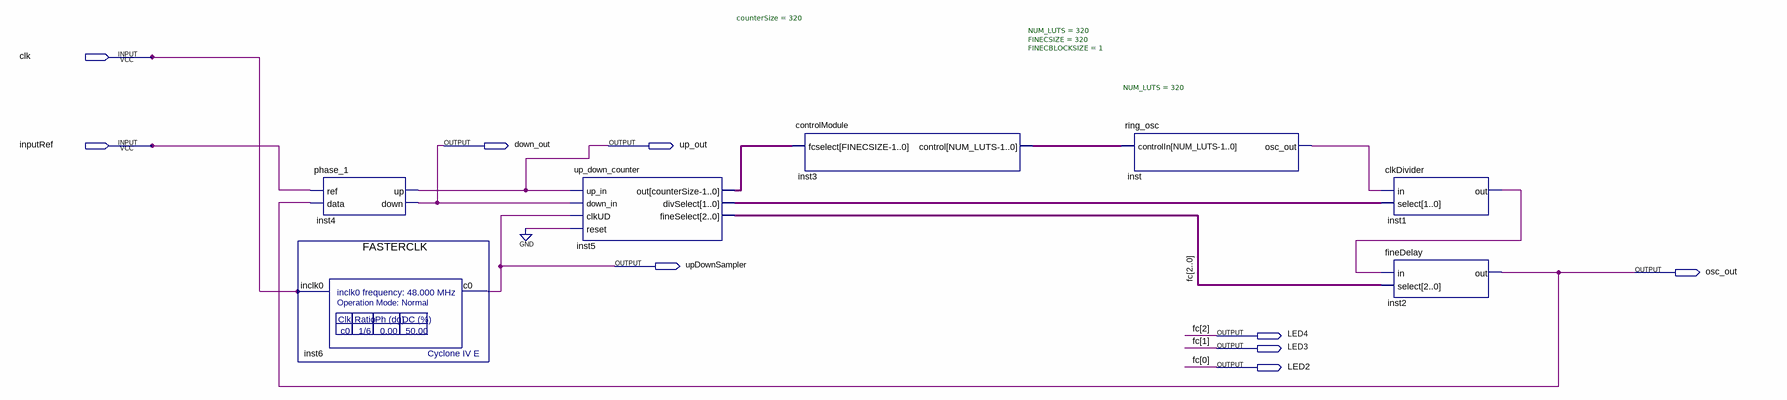
[diagram p0: schematic sheet]
// Quartus schematic top.bdf as structural Verilog: 7 symbols, 9 pins
module top (
  input  clk,
  input  inputRef,
  output down_out,
  output up_out,
  output upDownSampler,
  output osc_out,
  output LED4,
  output LED3,
  output LED2
);

  wire inst1_out, inst_osc_out;
  wire [1:0] inst5_divselect;
  wire [319:0] inst3_control, inst5_out;

  FASTERCLK inst6 (.inclk0(clk), .c0(upDownSampler));
  phase_1 inst4 (.\ref (inputRef), .data(osc_out), .up(up_out), .down(down_out));
  up_down_counter #(.counterSize(320)) inst5 (
    .up_in(up_out), .down_in(down_out), .clkUD(upDownSampler), .reset(1'b0), .out(inst5_out),
    .divSelect(inst5_divselect), .fineSelect({LED4, LED3, LED2}));
  controlModule #(.NUM_LUTS(320), .FINECSIZE(320), .FINECBLOCKSIZE(1)) inst3 (
    .fcselect(inst5_out), .control(inst3_control));
  ring_osc #(.NUM_LUTS(320)) inst (.controlIn(inst3_control), .osc_out(inst_osc_out));
  clkDivider inst1 (.in(inst_osc_out), .select(inst5_divselect), .out(inst1_out));
  fineDelay inst2 (.in(inst1_out), .select({LED4, LED3, LED2}), .out(osc_out));

  // Other names for the same wires on the sheet: fc[2:0] = {LED4, LED3, LED2}
endmodule
